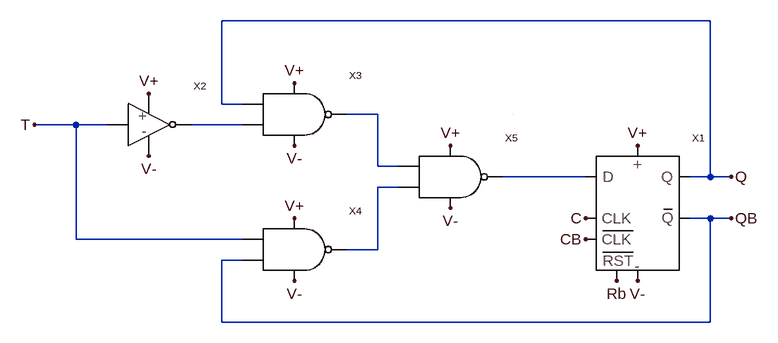
[diagram p0: schematic T_FlipFlopReset_FE.asc]
T_FlipFlopReset_FE.asc, the LTspice schematic file:
Version 4
SHEET 1 880 680
WIRE 304 -144 -448 -144
WIRE -448 -16 -448 -144
WIRE -416 -16 -448 -16
WIRE -208 0 -256 0
WIRE -672 16 -736 16
WIRE -624 16 -672 16
WIRE -416 16 -496 16
WIRE -208 80 -208 0
WIRE -176 80 -208 80
WIRE 112 96 -16 96
WIRE 304 96 304 -144
WIRE 304 96 272 96
WIRE 336 96 304 96
WIRE -176 112 -208 112
WIRE 304 160 272 160
WIRE 336 160 304 160
WIRE -672 192 -672 16
WIRE -416 192 -672 192
WIRE -208 208 -208 112
WIRE -208 208 -256 208
WIRE -416 224 -448 224
WIRE -448 320 -448 224
WIRE 304 320 304 160
WIRE 304 320 -448 320
WIRE 0 0 0 0
FLAG 112 160 C
FLAG 112 192 CB
FLAG 160 256 Rb
FLAG -336 -48 V+
FLAG -336 48 V-
FLAG -336 160 V+
FLAG -336 256 V-
FLAG 192 48 V+
FLAG 192 256 V-
FLAG -560 -32 V+
FLAG -560 64 V-
FLAG -736 16 T
FLAG 336 96 Q
FLAG 336 160 QB
FLAG -96 48 V+
FLAG -96 144 V-
SYMBOL Inverter -560 16 R0
SYMATTR InstName X2
SYMATTR SpiceLine nmosL=0.9u nmosW=3u pmosL=0.9u pmosW=6u
SYMBOL FlipFlop 192 160 R0
SYMATTR InstName X1
SYMATTR SpiceLine nmosL=0.9u nmosW=3u pmosL=0.9u pmosW=6u
SYMBOL NAND -336 0 R0
SYMATTR InstName X3
SYMATTR SpiceLine nmosL=0.9u nmosW=3u pmosL=0.9u pmosW=6u
SYMBOL NAND -336 208 R0
SYMATTR InstName X4
SYMATTR SpiceLine nmosL=0.9u nmosW=3u pmosL=0.9u pmosW=6u
SYMBOL NAND -96 96 R0
SYMATTR InstName X5
SYMATTR SpiceLine nmosL=0.9u nmosW=3u pmosL=0.9u pmosW=6u

The netlist it stands for:
* T_FlipFlopReset_FE.asc
XX2 T N002 V+ V- Inverter nmosL=0.9u nmosW=3u pmosL=0.9u pmosW=6u  ; pins IN OUT pos neg
XX1 N003 C CB Q QB Rb V+ V- FlipFlop nmosL=0.9u nmosW=3u pmosL=0.9u pmosW=6u  ; pins D CLK CLKb Q Qb RESETb pos neg
XX3 Q N001 N002 V+ V- NAND nmosL=0.9u nmosW=3u pmosL=0.9u pmosW=6u  ; pins A OUT B Vdd GROUND
XX4 T N004 QB V+ V- NAND nmosL=0.9u nmosW=3u pmosL=0.9u pmosW=6u  ; pins A OUT B Vdd GROUND
XX5 N001 N003 N004 V+ V- NAND nmosL=0.9u nmosW=3u pmosL=0.9u pmosW=6u  ; pins A OUT B Vdd GROUND
.backanno
.end